# EAGLE schematic H-Bridge (EAGLE 9.6.2)
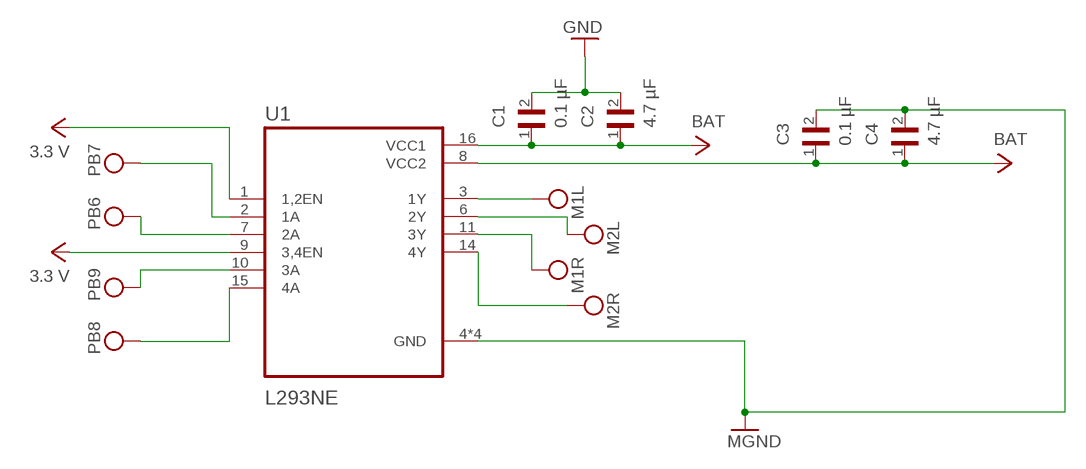
[diagram p0: schematic, sheet 1]

## Parts
C1  0.1 µF  GRM21BR71A106KA73L  [CAPC2012X140N]
C2  4.7 µF  GRM21BR71A106KA73L  [CAPC2012X140N]
C3  0.1 µF  GRM21BR71A106KA73L  [CAPC2012X140N]
C4  4.7 µF  GRM21BR71A106KA73L  [CAPC2012X140N]
U1  L293NE  [DIP762W45P254L1980H508Q16]

## Nets
GND: C1.2 C2.2 C3.2 C4.2 U1.4(GND) U1.5(GND) U1.12(GND) U1.13(GND) ; supply symbol labelled MGND
VCC: C1.1 C2.1 C3.1 C4.1 U1.1(1,2EN) U1.2(1A) U1.3(1Y) U1.6(2Y) U1.7(2A) U1.8(VCC2) U1.9(3,4EN) U1.10(3A) U1.11(3Y) U1.14(4Y) U1.15(4A) U1.16(VCC1) ; supply symbol labelled BAT, 3.3 V, PB7, PB6, PB9, PB8, M1L, M2L, M1R, M2R

## Library data of the parts
C1-C4 = GRM21BR71A106KA73L:GRM21BR71A106KA73L: SMD Capacitor X7R(EIA) with Capacitance: 10uF Tol. 10%. Rated Voltage: 10Vdc; DESCRIPTION: SMD capacitor X7R(EIA) with capacitance 10uF Tol.10%. Rated voltage 10Vdc 125C; DIGI-KEY_PART_NUMBER: 490-10516-1-ND; MF: Murata Electronics; MP: GRM21BR71A106KA73L; PACKAGE: 2012 Murata; PURCHASE-URL: https://pricing.snapeda.com/search/part/GRM21BR71A106KA73L/?ref=eda
U1 = L293NE:L293NE: Check prices <https://pricing.snapeda.com/parts/L293NE/Texas%20Instruments/view-part?ref=eda>; AVAILABILITY: Warning; DESCRIPTION: Quadruple Half-H Drivers 16-PDIP 0 to 70; MF: Texas Instruments; MP: L293NE; PACKAGE: PDIP-16 Texas Instruments; PRICE: None; PURCHASE-URL: https://pricing.snapeda.com/search/part/L293NE/?ref=eda